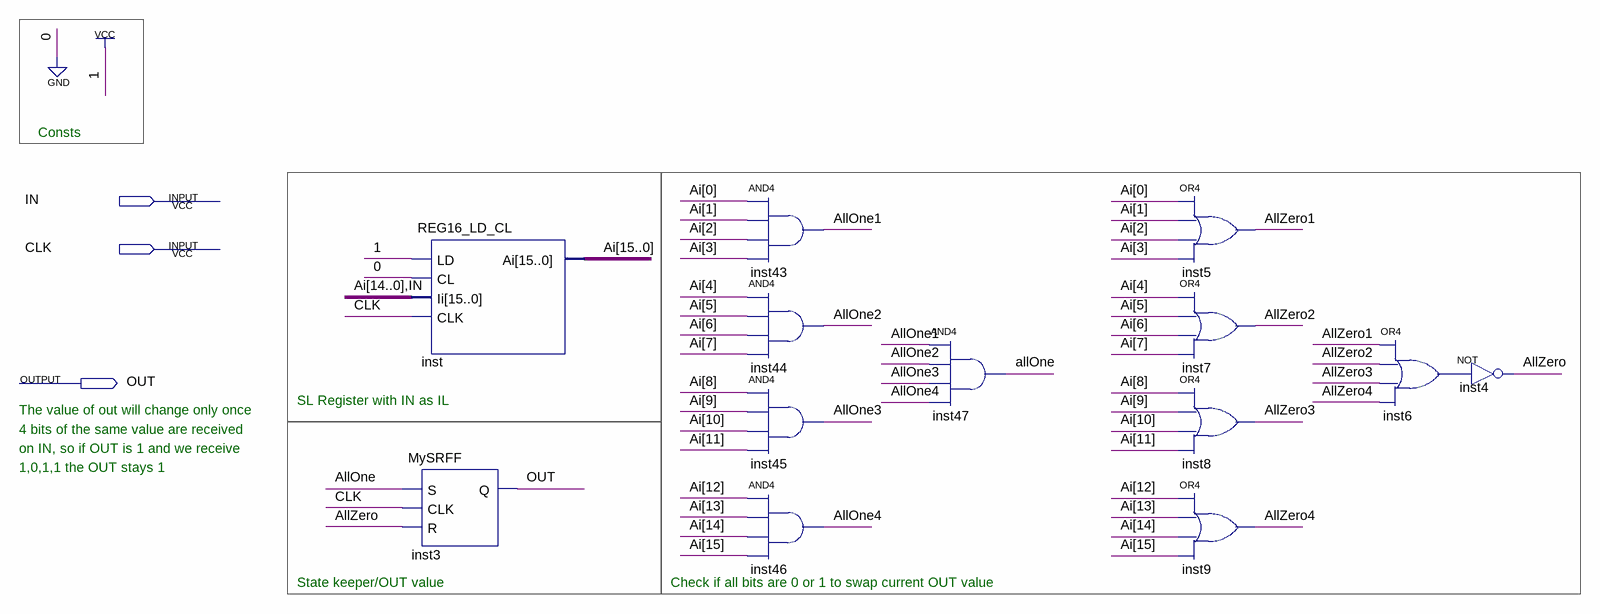
[diagram p0: schematic sheet]
// Quartus schematic Debouncer.bdf as structural Verilog: 13 symbols, 3 pins
module Debouncer (
  input  IN,
  input  CLK,
  output OUT
);

  wire AllOne, AllOne1, AllOne2, AllOne3, AllOne4, AllZero, AllZero1, AllZero2, AllZero3, AllZero4, inst6_out;
  wire [15:0] Ai;

  REG16_LD_CL inst (.LD(1'b1), .CL(1'b0), .Ii({Ai[14:0], IN}), .CLK(CLK), .Ai(Ai));
  MySRFF inst3 (.S(AllOne), .CLK(CLK), .R(AllZero), .Q(OUT));
  and inst43 (AllOne1, Ai[0], Ai[1], Ai[2], Ai[3]);
  and inst44 (AllOne2, Ai[4], Ai[5], Ai[6], Ai[7]);
  and inst45 (AllOne3, Ai[8], Ai[9], Ai[10], Ai[11]);
  and inst46 (AllOne4, Ai[12], Ai[13], Ai[14], Ai[15]);
  and inst47 (AllOne, AllOne1, AllOne2, AllOne3, AllOne4);
  or inst5 (AllZero1, Ai[0], Ai[1], Ai[2], Ai[3]);
  or inst7 (AllZero2, Ai[4], Ai[5], Ai[6], Ai[7]);
  or inst8 (AllZero3, Ai[8], Ai[9], Ai[10], Ai[11]);
  or inst9 (AllZero4, Ai[12], Ai[13], Ai[14], Ai[15]);
  or inst6 (inst6_out, AllZero1, AllZero2, AllZero3, AllZero4);
  not inst4 (AllZero, inst6_out);

  // Notes on the sheet:
  //   Consts
  //   SL Register with IN as IL
  //   The value of out will change only once
  //   4 bits of the same value are received
  //   on IN, so if OUT is 1 and we receive
  //   1,0,1,1 the OUT stays 1
  //   State keeper/OUT value
  //   Check if all bits are 0 or 1 to swap current OUT value
endmodule
